# Altium schematic sheet modFOC_Supply.SchDoc: modFOC-Supply
size A4; Author: Mathias Giller; CompanyName: HTL St. Pölten; Address1: modFOC; DocumentNumber: 7; Revision: 2.0; SheetNumber: 7; SheetTotal: 7
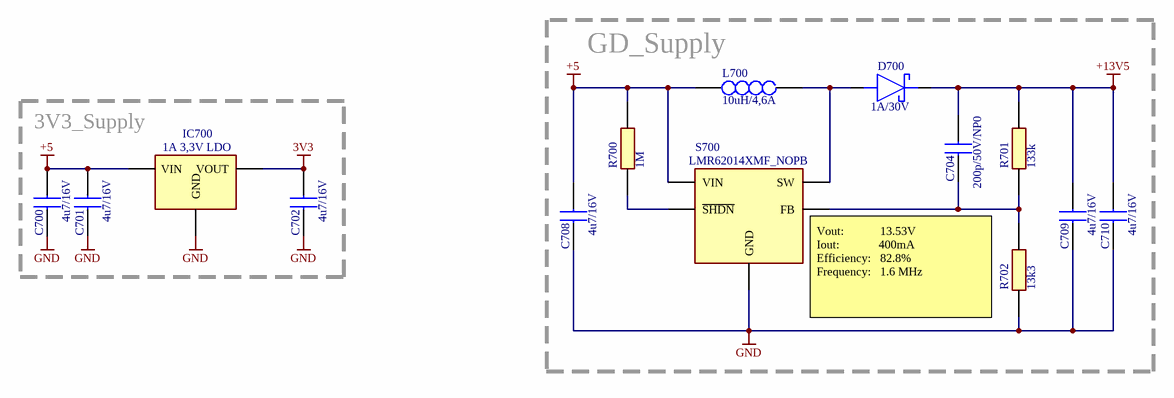
[diagram p0: modFOC_Supply.SchDoc]

## Parts
C700  4u7/16V  [CAPC1608X97N]
C701  4u7/16V  [CAPC1608X97N]
C702  4u7/16V  [CAPC1608X97N]
C704  200p/50V/NP0  [CAPC1608X90N]
C708  4u7/16V  [CAPC1608X97N]
C709  4u7/16V  [CAPC1608X97N]
C710  4u7/16V  [CAPC1608X97N]
D700  1A/30V  [SODFL5226X110N]
IC700  1A 3,3V LDO  [SOT230P700X180-4N]
L700  10uH/4,6A  [74438357100]
R700  1M  [RESC1608X55N]
R701  133k  [RESC1608X55N]
R702  13k3  [RESC1608X55N]
S700  LMR62014XMF_NOPB  [SOT95P280X145-5N]

## Blocks framed on the sheet
GD_Supply: C704 C708-C710 D700 L700 R700-R702 S700
3V3_Supply: C700-C702 IC700

## Nets
3V3: C702.1 IC700.2,4(VOUT)
+5: C700.1 C701.1 C708.1 IC700.3(VIN) L700.1 R700.2 S700.5(VIN)
+13V5: C704.1 C709.1 C710.1 D700.1(K) R701.1
GND: C700.2 C701.2 C702.2 C708.2 C709.2 C710.2 IC700.1(GND) R702.2 S700.2(GND)
NetC704_2: C704.2 R701.2 R702.1 S700.3(FB)
NetD700_2: D700.2(A) L700.2 S700.1(SW)
NetR700_1: R700.1 S700.4(~{SHDN})

## Notes on the sheet
- (near S700) Vout:            13.53V
  Iout:             400mA
  Efficiency:   82.8%
  Frequency:   1.6 MHz
- Title
- Size:
- Date:
- A4
- Number:
- Time:
- Revision:
- Sheet
- of
- File:

## Library data of the parts
C700-C702 C708-C710 = C0603: Capacitor
C704 = GRM1885C1H201JA01D: Capacitor; Manufacturer_Name: Murata Electronics; Datasheet Link: http://www.murata.com/~/media/webrenewal/support/library/catalog/products/capacitor/mlcc/c02e.pdf; Height: 0.9mm; Manufacturer_Part_Number: GRM1885C1H201JA01D; Mouser Part Number: 81-GRM39C201J50; Mouser Price/Stock: https://www.mouser.com/Search/Refine.aspx?Keyword=81-GRM39C201J50
D700 = STPS1L30AFN: Schottky Diode; Manufacturer_Name: STMicroelectronics; Datasheet Link: https://4donline.ihs.com/images/VipMasterIC/IC/SGST/SGST-S-A0009026271/SGST-S-A0009026271-1.pdf?hkey=6D3A4C79FDBF58556ACFDE234799DDF0; Height: 1.1mm; Manufacturer_Part_Number: STPS1L30AFN; Mouser Part Number: 511-STPS1L30AFN; Mouser Price/Stock: https://www.mouser.co.uk/ProductDetail/STMicroelectronics/STPS1L30AFN?qs=Cb2nCFKsA8pl%252BsoFM6iGfw%3D%3D; Arrow Part Number: STPS1L30AFN; Arrow Price/Stock: https://www.arrow.com/en/products/stps1l30afn/stmicroelectronics?region=nac
IC700 = AP2114H-3.3TRG1: 3V3 LDO; Manufacturer_Name: Diodes Inc.; Datasheet Link: http://uk.rs-online.com/web/p/products/8283528; Height: 1.8mm; Manufacturer_Part_Number: AP2114H-3.3TRG1; Arrow Part Number: AP2114H-3.3TRG1; Arrow Price/Stock: https://www.arrow.com/en/products/ap2114h-3.3trg1/diodes-incorporated; Mouser Part Number: 621-AP2114H-3.3TRG1; Mouser Price/Stock: https://www.mouser.co.uk/ProductDetail/Diodes-Incorporated/AP2114H-33TRG1?qs=x6A8l6qLYDDSG%2FfwzcsOhw%3D%3D
L700 = 74438357100: Inductor; Manufacturer_Name: Wurth Elektronik; Datasheet Link: https://katalog.we-online.com/pbs/datasheet/74438357100.pdf; Height: 4mm; Manufacturer_Part_Number: 74438357100; Mouser Part Number: 710-74438357100; Mouser Price/Stock: https://www.mouser.co.uk/ProductDetail/Wurth-Elektronik/74438357100?qs=AQlKX63v8RsOZwIYXNHv7w%3D%3D
R700 = RC0603FR-071ML: Resistor; Manufacturer_Name: YAGEO (PHYCOMP); Datasheet Link: https://www.yageo.com/upload/media/product/productsearch/datasheet/rchip/PYu-RC_Group_51_RoHS_L_11.pdf; Height: 0.55mm; Manufacturer_Part_Number: RC0603FR-071ML; Mouser Part Number: 603-RC0603FR-071ML; Mouser Price/Stock: https://www.mouser.co.uk/ProductDetail/Yageo/RC0603FR-071ML/?qs=VU8sRB4EgwDPceeQKB324w%3D%3D; Arrow Part Number: RC0603FR-071ML; Arrow Price/Stock: https://www.arrow.com/en/products/rc0603fr-071ml/yageo
R701 R702 = R0603: Resistor
S700 = LMR62014XMF_NOPB: Switch; Manufacturer_Name: Texas Instruments; Manufacturer_Part_Number: LMR62014XMF/NOPB; Datasheet Link: http://www.ti.com/lit/gpn/lmr62014; Height: 1.45mm; Mouser Part Number: 926-LMR62014XMF/NOPB; Mouser Price/Stock: https://www.mouser.co.uk/ProductDetail/Texas-Instruments/LMR62014XMF-NOPB?qs=cN01o9PeIQtA177Vn0GXdQ%3D%3D; Arrow Part Number: LMR62014XMF/NOPB; Arrow Price/Stock: https://www.arrow.com/en/products/lmr62014xmfnopb/texas-instruments